# EAGLE schematic AudioOutput (EAGLE 8.7.1)
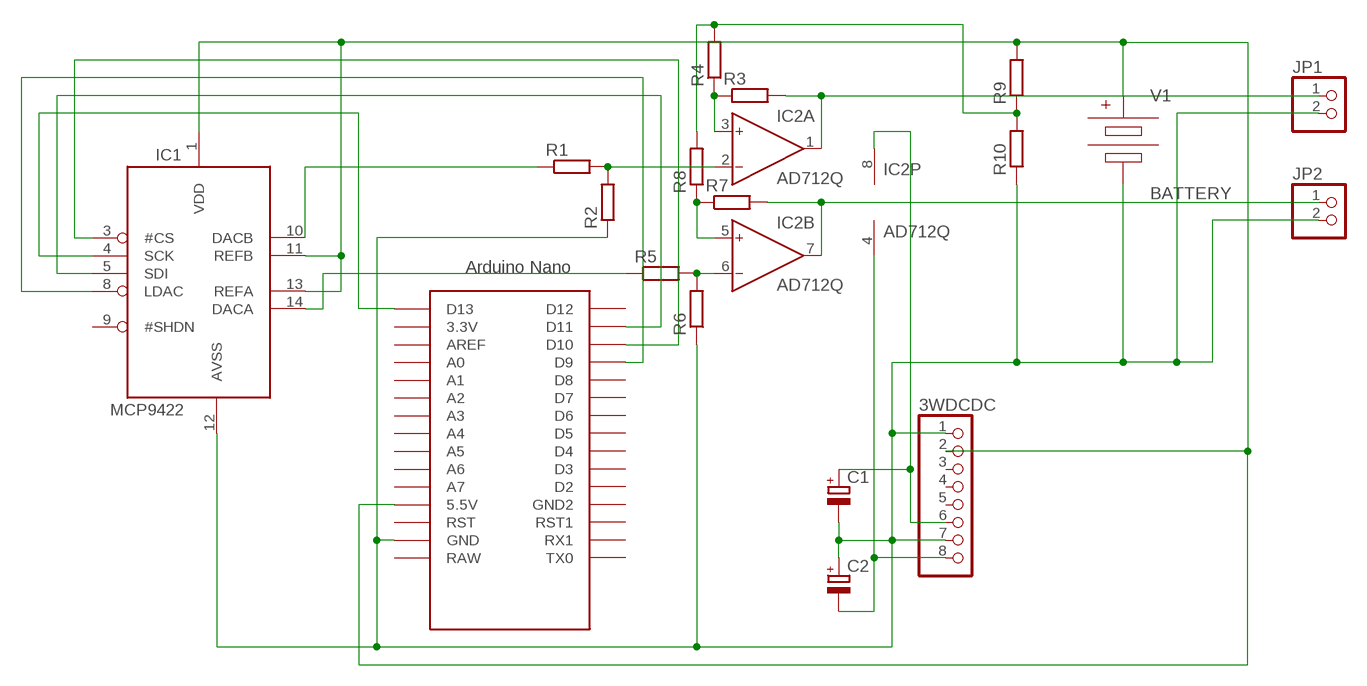
[diagram p0: schematic, sheet 1]

## Parts
3WDCDC  PINHD-1X8  [1X08]
C1  CPOL-EUE2.5-7  [E2,5-7]
C2  CPOL-EUE2.5-7  [E2,5-7]
IC1  MCP9422  [DIL14]
IC2  AD712Q  [DIL08]
JP1  PINHD-1X2  [1X02]
JP2  PINHD-1X2  [1X02]
R1  R-EU_0207/10  [0207/10]
R2  R-EU_0207/10  [0207/10]
R3  R-EU_0207/10  [0207/10]
R4  R-EU_0207/10  [0207/10]
R5  R-EU_0207/10  [0207/10]
R6  R-EU_0207/10  [0207/10]
R7  R-EU_0207/10  [0207/10]
R8  R-EU_0207/10  [0207/10]
R9  R-EU_0207/10  [0207/10]
R10  R-EU_0207/10  [0207/10]
U$1  NANO  [NANO]
V1  BATTERY  [3V60R]

## Nets
AVSS: 3WDCDC.1 3WDCDC.7 C1.- C2.+ IC1.12(AVSS) JP1.2 JP2.2 R2.1 R6.1 R10.1 U$1.GND V1.-
N$1: IC2.2(A:IN-) R1.2 R2.2
N$2: IC2.3(A:IN+) R3.1 R4.1
N$3: 3WDCDC.8 C2.- IC2.4(P:V-)
N$4: 3WDCDC.6 C1.+ IC2.8(P:V+)
N$5: IC2.6(B:IN-) R5.2 R6.2
N$6: IC2.5(B:IN+) R7.1 R8.1
N$7: IC2.7(B:OUT) JP2.1 R7.2
N$8: IC2.1(A:OUT) JP1.1 R3.2
N$9: IC1.5(SDI) U$1.D11
N$10: IC1.3(#CS) U$1.D10
N$11: IC1.4(SCK) U$1.D13
N$12: IC1.8(LDAC) U$1.D9
N$13: IC1.10(DACB) R1.1
N$14: IC1.14(DACA) R5.1
N$16: R4.2 R8.2 R9.1 R10.2
VDD: 3WDCDC.2 IC1.1(VDD) IC1.11(REFB) IC1.13(REFA) R9.2 U$1.5V(5.5V) V1.+ V1.+@1(+)
Unconnected: 3WDCDC.3 3WDCDC.4 3WDCDC.5 IC1.9(#SHDN) U$1.3.3V U$1.A0 U$1.A1 U$1.A2 U$1.A3 U$1.A4 U$1.A5 U$1.A6 U$1.A7 U$1.AREF U$1.D2 U$1.D3 U$1.D4 U$1.D5 U$1.D6 U$1.D7 U$1.D8 U$1.D12 U$1.GND1(GND2) U$1.ICSP1 U$1.ICSP2 U$1.ICSP3 U$1.ICSP4 U$1.ICSP5 U$1.ICSP6 U$1.RAW U$1.RST U$1.RST1 U$1.RX1 U$1.TX0

## Library data of the parts
3WDCDC = pinhead:PINHD-1X8: PIN HEADER
C1 C2 = rcl:CPOL-EU: POLARIZED CAPACITOR, European symbol; SPICEPREFIX: C
IC1 = adafruit:MCP9422
IC2 = analog-devices:AD712: Dual Precision, Low Cost, High Speed BiFET Op Amp Source: http://www.analog.com/static/imported-files/data_sheets/AD712.pdf; MF: ALTERA CORPORATION; MPN: AD712AQ; OC_FARNELL: 9604898; OC_NEWARK: 05F7274
JP1 JP2 = pinhead:PINHD-1X2: PIN HEADER
R1-R10 = rcl:R-EU_: RESISTOR, European symbol; SPICEPREFIX: R
U$1 = Arduino-clone:NANO: Arduino Nano
V1 = Misc:BATTERY: Voltage Source, either DC, AC, PULSE, SINE, PWL, EXP, or SFFM